# EAGLE design fablab-example (EAGLE 7.3.0)
CNAME: Paperduino PCB; CREVISION: 1; DESIGNER: Mosab Wadea
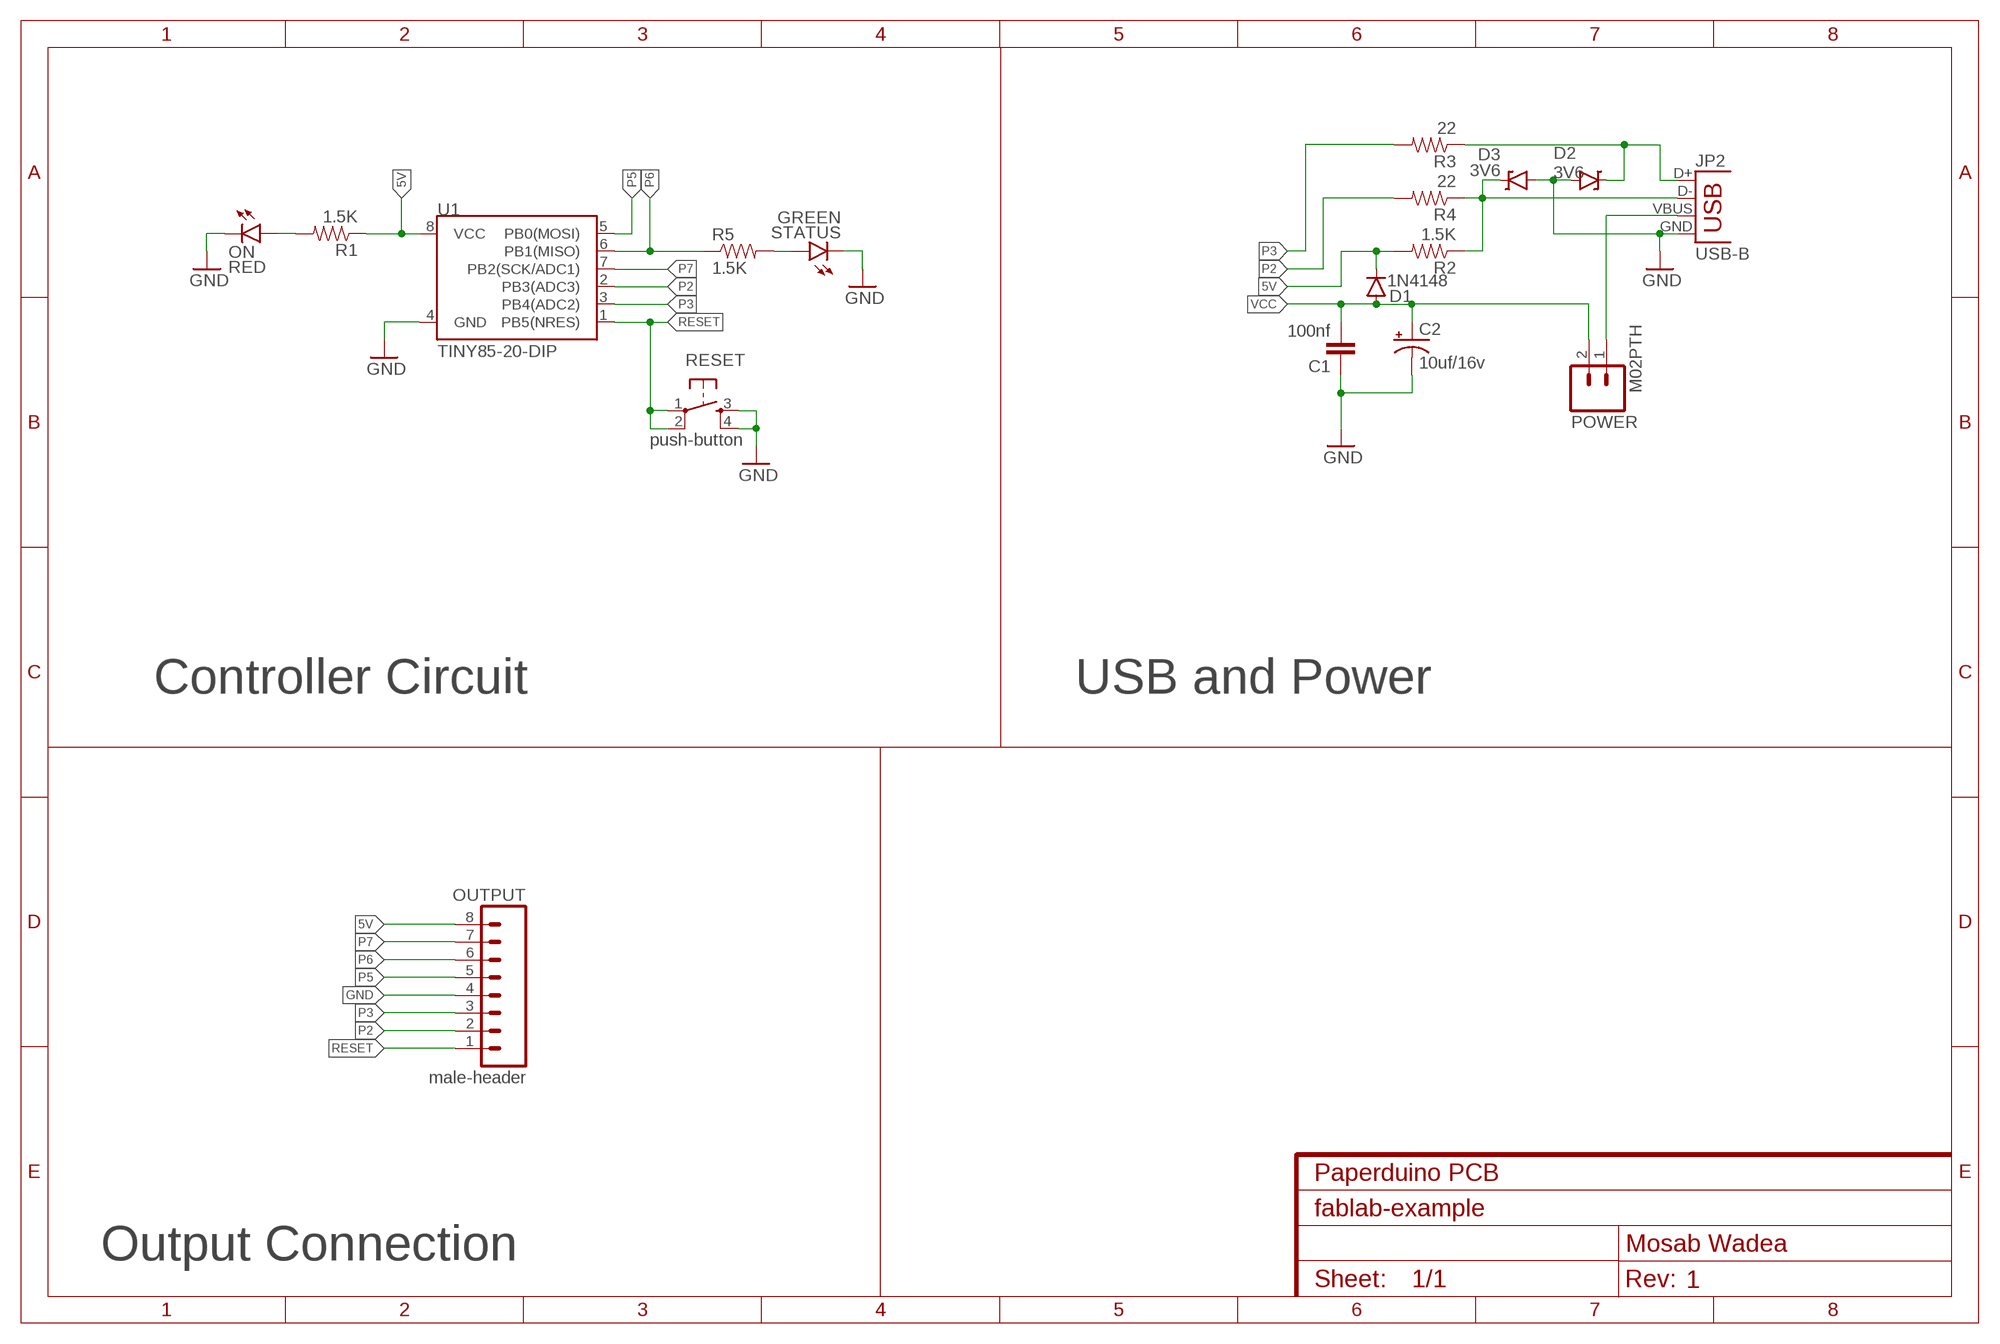
[diagram p0: schematic, sheet 1]

## Parts
C1  100nf  CAPPTH  [CAP-PTH-SMALL]
C2  10uf/16v  CAP_POLPTH2  [CPOL-RADIAL-10UF-25V]
D1  1N4148  DIODE1N4148  [DIODE-1N4148]
D2  3V6  DIODE-ZENERPTH  [DIODE-ZENER]
D3  3V6  DIODE-ZENERPTH  [DIODE-ZENER]
JP2  USB-B  USBPTH  [USB-B-PTH]
ON  RED  LED3MM  [LED3MM]
OUTPUT  male-header  M08  [1X08_ROUND]
POWER  M02PTH  [1X02]
R1  1.5K  RESISTOR1206  [1206]
R2  1.5K  RESISTOR1206  [1206]
R3  22  RESISTOR1206  [1206]
R4  22  RESISTOR1206  [1206]
R5  1.5K  RESISTOR1206  [1206]
RESET  push-button  TAC_SWITCHPTH  [TACTILE-PTH]
STATUS  GREEN  LED3MM  [LED3MM]
U1  TINY85-20-DIP  ATTINY45TINY85-20-DIP  [DIP08]

## Nets
5V: D1.C OUTPUT.8 R1.1 R2.2 U1.8(VCC)
GND: C1.1 C2.2(-) D2.P$2(A) D3.P$2(A) JP2.GND ON.K(C) OUTPUT.4 RESET.3 RESET.4 STATUS.K(C) U1.4(GND)
N$3: ON.A R1.2
N$4: R5.2 STATUS.A
N$10: D2.P$1(C) JP2.D+ R3.1
N$11: D3.P$1(C) JP2.D- R2.1 R4.1
N$13: JP2.VBUS POWER.1
P2: OUTPUT.2 R4.2 U1.2(PB3(ADC3))
P3: OUTPUT.3 R3.2 U1.3(PB4(ADC2))
P5: OUTPUT.5 U1.5(PB0(MOSI))
P6: OUTPUT.6 R5.1 U1.6(PB1(MISO))
P7: OUTPUT.7 U1.7(PB2(SCK/ADC1))
RESET: OUTPUT.1 RESET.1 RESET.2 U1.1(PB5(NRES))
VCC: C1.2 C2.1(+) D1.A POWER.2

## Notes on the sheet
- Controller Circuit | USB and Power
- Output Connection

## Library data of the parts
C1 = SparkFun-Capacitors:CAP: Capacitor Standard 0603 ceramic capacitor, and 0.1" leaded capacitor.
C2 = SparkFun-Capacitors:CAP_POL: Capacitor Polarized These are standard SMD and PTH capacitors. Normally 10uF, 47uF, and 100uF in electrolytic and tantalum varieties. Always verify the external diameter of the through hole cap, it varies with capacity, voltage, and manufacturer. The EIA devices should be standard.
D1 = SparkFun-DiscreteSemi:DIODE: Diode These are standard reverse protection diodes and small signal diodes. SMA package can handle up to about 1A. SOD-323 can handle about 200mA. What the SOD-323 package when ordering, there are some mfgs out there that are 5-pin packages.
D2 D3 = SparkFun-DiscreteSemi:DIODE-ZENER: Zener Diode Production Part - 8199 3.4V Zener Voltage
JP2 = SparkFun-Connectors:USB: USB Connectors USB-B-PTH is fully proven SKU : PRT-00139/CONN-08278 USB-miniB is fully proven SKU : PRT-00587 USB-A-PCB is untested. USB-A-H is throughly reviewed, but untested. Spark Fun Electronics SKU : PRT-00437 USB-B-SMT is throughly reviewed, but untested. Needs silkscreen touching up. USB-A-S has not been used/tested USB-MB-H has not been used/tested USB-MICROB has been used. CONN-09505; PROD_ID: CONN-08278
ON STATUS = SparkFun-LED:LED: LEDs Standard schematic elements and footprints for 5mm, 3mm, 1206, and 0603 sized LEDs. 5mm - Spark Fun Electronics SKU : COM-00529 (and others)
OUTPUT = SparkFun-Connectors:M08: Header 8 Standard 8-pin 0.1" header. Use with straight break away headers (SKU : PRT-00116), right angle break away headers (PRT-00553), swiss pins (PRT-00743), machine pins (PRT-00117), and female headers (PRT-00115).
POWER = SparkFun-Connectors:M02: Standard 2-pin 0.1" header. Use with - straight break away headers ( PRT-00116) - right angle break away headers (PRT-00553) - swiss pins (PRT-00743) - machine pins (PRT-00117) - female headers (PRT-00115) Molex polarized connector foot print use with: PRT-08233 with associated crimp pins and housings. 2.54_SCREWTERM for use with PRT-10571. 3.5mm Screw Terminal footprints for PRT-08084 5mm Screw Terminal footprints for use with PRT-08432
R1-R5 = SparkFun-Resistors:RESISTOR: Resistor Basic schematic elements and footprints for 0603, 1206, and PTH resistors.
RESET = SparkFun-Retired:TAC_SWITCH: Momentary Switch Button commonly used for reset or general input. Spark Fun Electronics SKU : COM-00097 SMT- SWCH-08247
U1 = SparkFun-DigitalIC:ATTINY45: Atmel 8-pin 2/4/8kB flash uC; PROD_ID: IC-09445

## Net classes
0 default: width 0.508 mm, clearance 0.406 mm

## Board
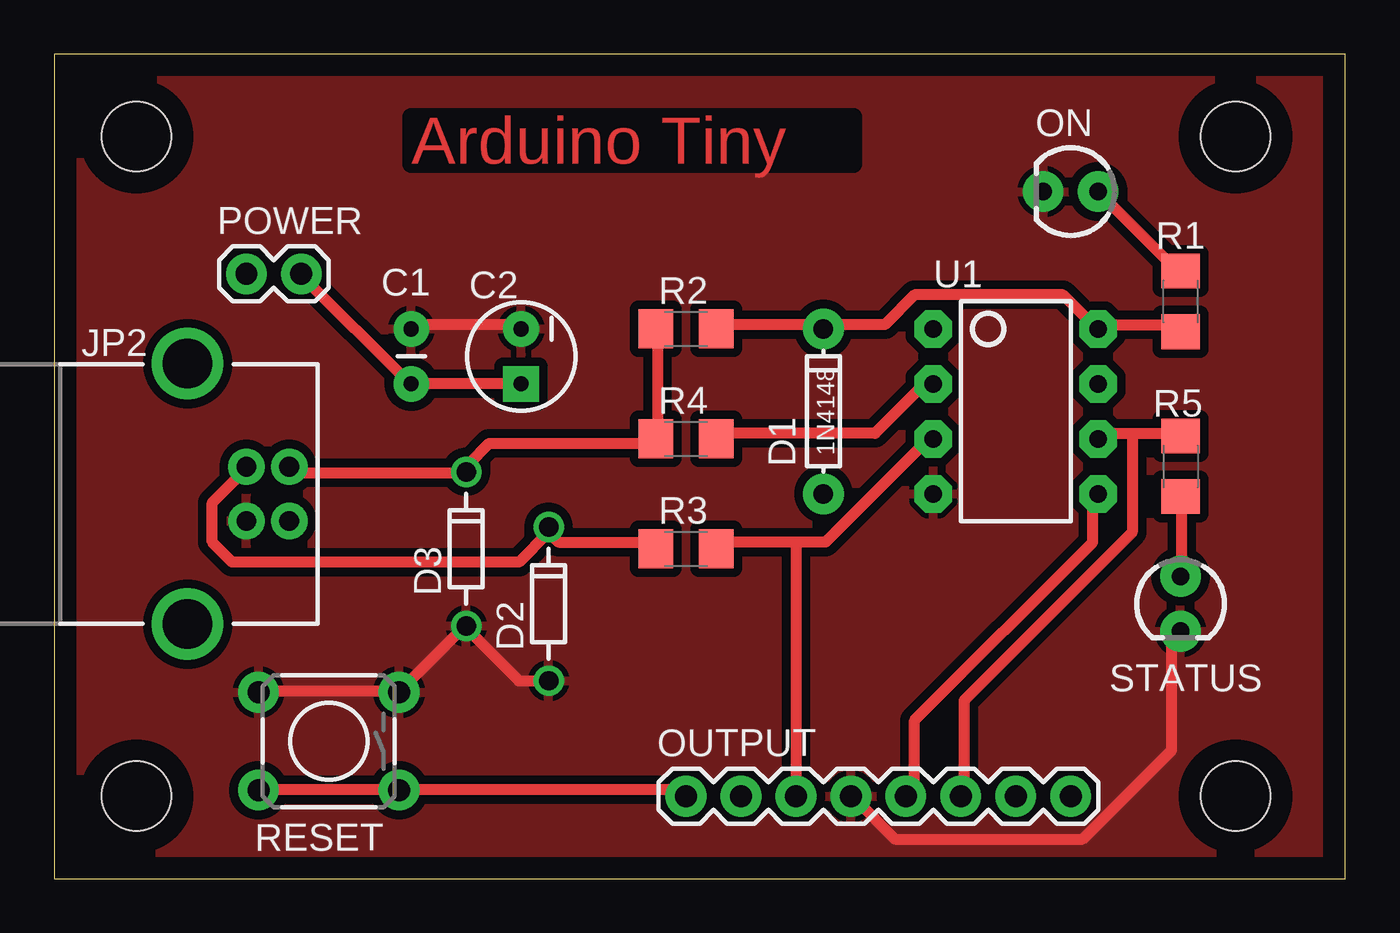
[diagram p1: board, top side]
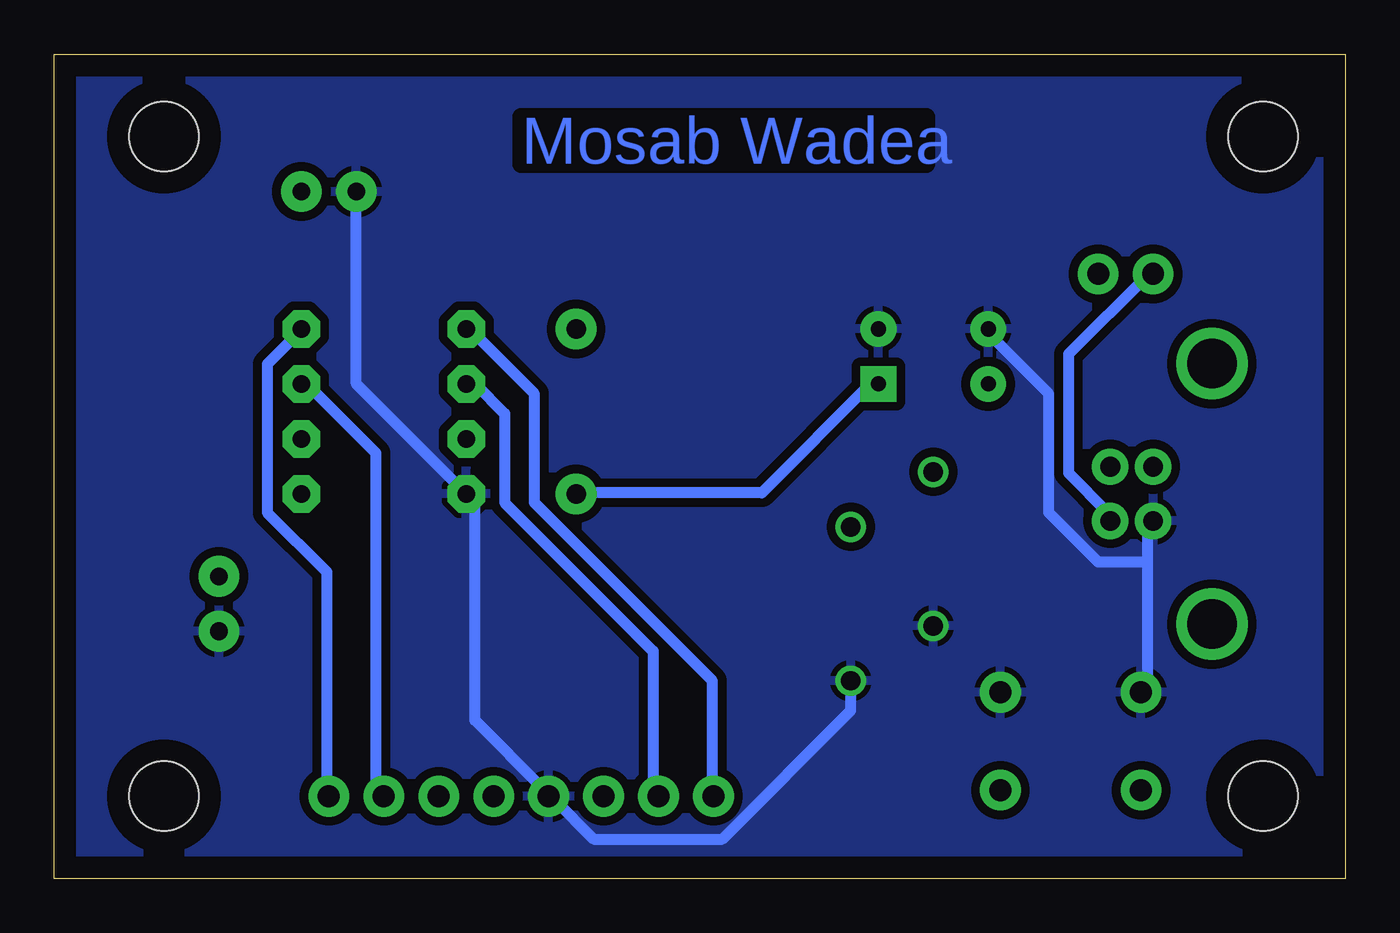
[diagram p2: board, bottom side, seen from below]

Size 59.69 x 38.1 mm. Coordinates in mm from the lower left corner, seen from the top.
Outline: 0,0 59.69,0 59.69,38.1 0,38.09 0,0
Copper layers (1*16): Top 0.035mm / dielectric 1.5mm / Bottom 0.035mm
Design rules "default": minimum track width 10mil, minimum drill 24mil, track to track 8mil, track to pad 8mil, pad to pad 8mil, via to via 8mil, smd to smd 8mil, copper to edge 40mil, drill to drill 8mil, minimum pad ring 10mil, minimum via ring 8mil, stop-mask expansion 4mil, vias tented up to drill 0mil, thermal gap 10mil
Holes 3.2 mm at 54.61,34.29 54.61,3.81 3.81,3.81 3.81,34.29

### Footprints (pad centres in the part's own frame; a part is rotated, then mirrored left to right if it is on the bottom)
CAP-PTH-SMALL = drill 0.7 pad 1.651: 1 0,0; 2 2.54,0
CPOL-RADIAL-10UF-25V = drill 0.7 pad 1.651 square: 1 1.27,0 | drill 0.7 pad 1.651: 2 -1.27,0
DIODE-1N4148 = drill 0.9 pad 1.88: A -3.81,0; C 3.81,0
DIODE-ZENER = drill 0.9: P$1 -3.556,0; P$2 3.556,0
USB-B-PTH = drill 0.914 pad 1.676: D+ 0,1.25; D- 1.981,1.25; GND 0,-1.25; VBUS 1.981,-1.25 | drill 2.286: S1 -2.718,-6.02; S2 -2.718,6.02
LED3MM = drill 0.813 pad 1.88: A -1.27,0; K 1.27,0
1X08_ROUND = drill 1.016 pad 1.88: 1 0,0; 2 2.54,0; 3 5.08,0; 4 7.62,0; 5 10.16,0; 6 12.7,0; 7 15.24,0; 8 17.78,0
1X02 = drill 1.016 pad 1.88: 1 0,0; 2 2.54,0
1206 = smd 1.6 x 1.8: 1 -1.4,0; 2 1.4,0
TACTILE-PTH = drill 1.016 pad 1.88: 1 -3.251,2.261; 2 3.251,2.261; 3 -3.251,-2.261; 4 3.251,-2.261
DIP08 = drill 0.813 pad 1.727 octagon: 1 -3.81,-3.81; 2 -1.27,-3.81; 3 1.27,-3.81; 4 3.81,-3.81; 5 3.81,3.81; 6 1.27,3.81; 7 -1.27,3.81; 8 -3.81,3.81

### Placement (x,y rotation side)
_REFERENCE_HOLE_  [_REFERENCE_HOLE_]  0,0 0 top
C1  16.51,25.4 270 top
C2  21.59,24.13 270 top
D1  35.56,21.59 90 top
D2  22.86,12.7 270 top
D3  19.05,15.24 270 top
JP2  8.89,17.78 0 top
ON  46.99,31.75 180 top
OUTPUT  29.21,3.81 0 top
POWER  8.89,27.94 0 top
R1  52.07,26.67 90 top
R2  29.21,25.4 0 top
R3  29.21,15.24 0 top
R4  29.21,20.32 0 top
R5  52.07,19.05 270 top
RESET  12.7,6.35 180 top
STATUS  52.07,12.7 270 top
U1  44.45,21.59 270 top

### Tracks (layer width: path | path; a pad name or v marks a point on that pad's centre or on a via)
5V
  Top 0.508: R2.2 30.63,25.6 35.2,25.6 D1.C 35.66,25.6 38.41,25.6 39.78,26.98 46.63,26.98 48.01,25.6 U1.8 48.46,25.6 51.66,25.6 R1.1
  Bottom 0.508: OUTPUT.8 47.09,4.12 47.09,14.17 49.84,16.92 49.84,23.77 48.46,25.15 U1.8
GND
  Top 0.508: D2.P$2 21.49,9.14 19.2,11.43 D3.P$2 18.75,11.43 16,8.69 RESET.3 15.54,8.69 9.6,8.69 RESET.4 | C1.1 16.92,25.6 21.49,25.6 C2.2 | STATUS.K 51.66,11.43 51.66,5.94 47.55,1.83 38.86,1.83 37.03,3.66 OUTPUT.4
  Bottom 0.508: 9.14,14.63 9.14,8.69 RESET.4 | 9.14,14.63 9.14,16.46 JP2.GND | 9.14,14.63 11.43,14.63 13.72,16.92 13.72,22.4 16.46,25.15 C1.1 | ON.K 45.72,22.86 U1.4 40.23,17.37 40.23,7.32 37.03,4.12 OUTPUT.4 36.58,3.66 34.75,1.83 28.8,1.83 22.86,7.77 D2.P$2
  pour Top: 0,38.1 59.69,38.1 59.69,0 0,0
  pour Bottom: 0,38.1 59.69,38.1 59.69,0 0,0
N$3
  Top 0.508: ON.A 51.66,28.35 R1.2
N$4
  Top 0.508: R5.2 52.12,17.37 52.12,14.17 STATUS.A
N$10
  Top 0.508: 22.86,16 23.32,15.54 27.43,15.54 R3.1 | 22.86,16 21.49,14.63 8.23,14.63 7.32,15.54 7.32,17.37 8.69,18.75 JP2.D+ | 22.86,16 D2.P$1
N$11
  Top 0.508: R2.1 27.89,25.15 27.89,20.57 R4.1 27.43,20.12 20.12,20.12 19.2,19.2 D3.P$1 18.75,18.75 10.97,18.75 JP2.D-
N$13
  Bottom 0.508: JP2.VBUS 10.97,16.92 12.8,18.75 12.8,24.23 9.14,27.89 POWER.1
P2
  Top 0.508: R4.2 30.63,20.57 37.95,20.57 40.23,22.86 U1.2
  Bottom 0.508: OUTPUT.2 32,4.12 32,10.52 38.86,17.37 38.86,21.49 40.23,22.86 U1.2
P3
  Top 0.508: 34.29,15.54 35.66,15.54 40.23,20.12 U1.3 | 34.29,15.54 30.63,15.54 R3.2 | 34.29,15.54 OUTPUT.3
P5
  Top 0.508: U1.5 48.01,17.37 48.01,15.54 39.78,7.32 39.78,4.12 OUTPUT.5
P6
  Top 0.508: 49.84,20.57 48.46,20.57 U1.6 | 49.84,20.57 51.66,20.57 R5.1 | 49.84,20.57 49.84,16 42.06,8.23 42.06,4.12 OUTPUT.6
P7
  Bottom 0.508: U1.7 48.01,22.86 44.81,19.66 44.81,4.12 OUTPUT.7
RESET
  Top 0.508: RESET.2 9.6,4.12 15.54,4.12 RESET.1 16,4.12 28.8,4.12 OUTPUT.1
  Bottom 0.508: U1.1 40.23,25.15 37.49,22.4 37.49,17.37 29.26,9.14 29.26,4.12 OUTPUT.1
VCC
  Top 0.508: C2.1 C1.2 16.46,22.86 11.43,27.89 POWER.2
  Bottom 0.508: D1.A 35.2,17.83 26.98,17.83 21.95,22.86 C2.1

### Text on the board
Top: Arduino Tiny
Bottom: Mosab Wadea